# Altium schematic sheet S7_Power.SchDoc
size A3
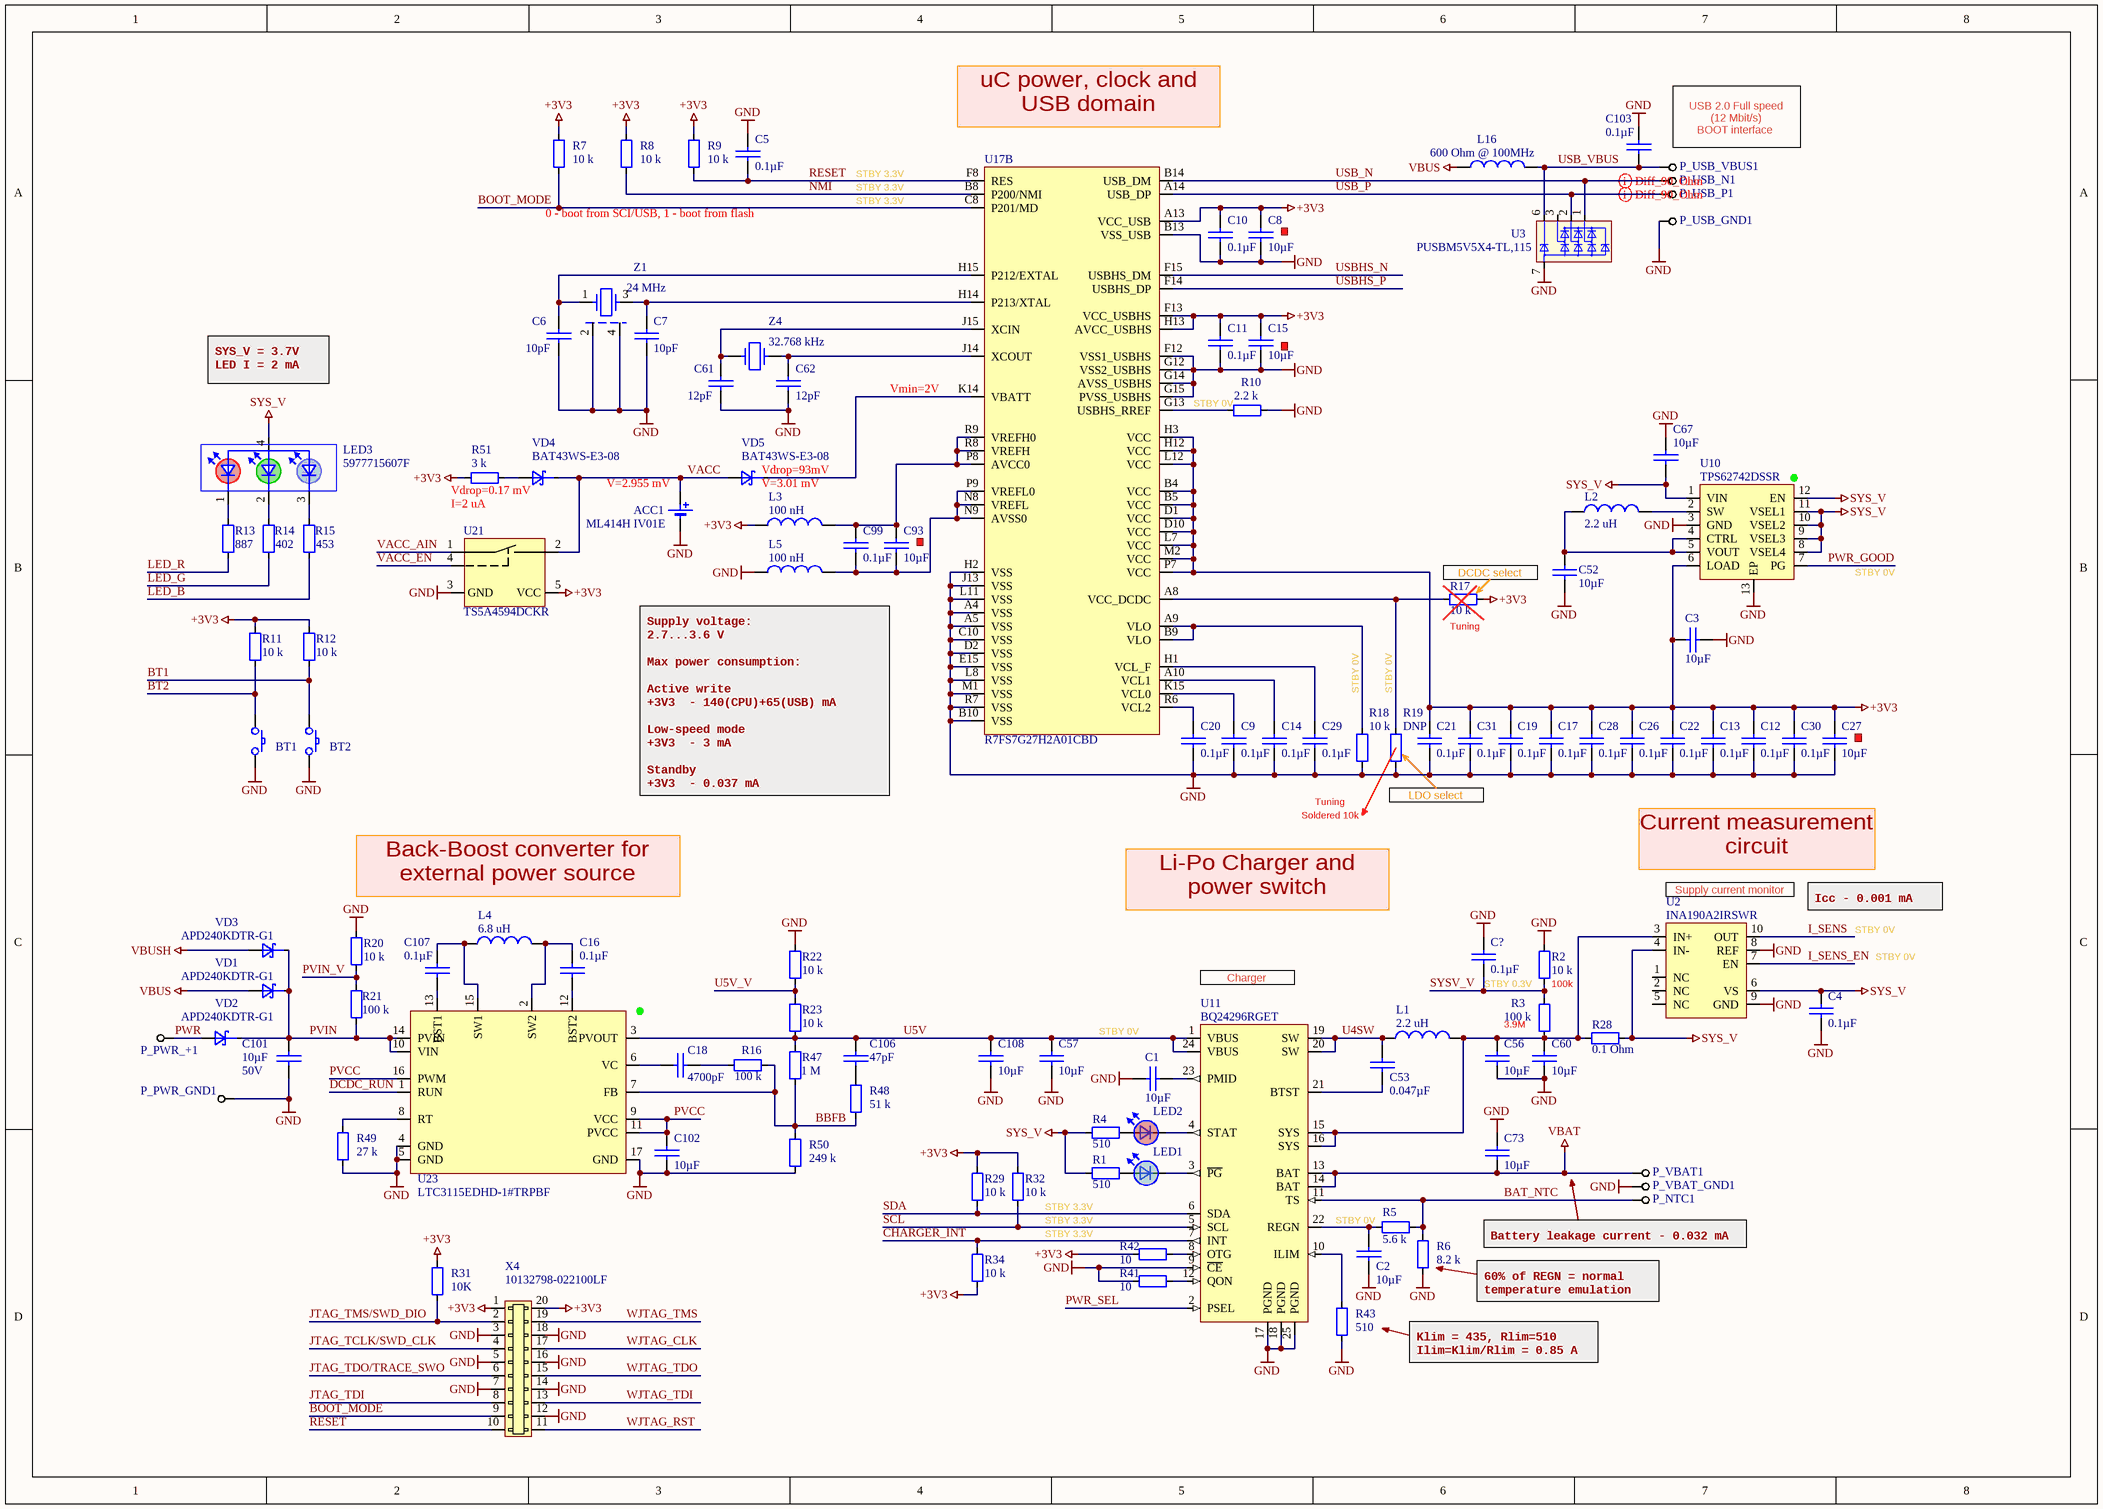
[diagram p0: S7_Power.SchDoc]

## Parts
ACC1  ML414H IV01E  [ML414H]
BT1  B3U-3000P  [B3U-3000P]  (value not drawn)
BT2  B3U-3000P  [B3U-3000P]  (value not drawn)
C1  value 10µF  [0603 CAP]  (hidden comment: Capacitor)
C2  value 10µF  [0603 CAP]  (hidden comment: Capacitor)
C3  value 10µF  [0603 CAP]  (hidden comment: Capacitor)
C4  value 0.1µF  [0402 CAP]  (hidden comment: Capacitor)
C5  value 0.1µF  [0402 CAP]  (hidden comment: Capacitor)
C6  value 10pF  [0402 CAP]  (hidden comment: Capacitor)
C7  value 10pF  [0402 CAP]  (hidden comment: Capacitor)
C8  value 10µF  [0603 CAP]  (hidden comment: Capacitor)
C9  value 0.1µF  [0402 CAP]  (hidden comment: Capacitor)
C10  value 0.1µF  [0402 CAP]  (hidden comment: Capacitor)
C11  value 0.1µF  [0402 CAP]  (hidden comment: Capacitor)
C12  value 0.1µF  [0402 CAP]  (hidden comment: Capacitor)
C13  value 0.1µF  [0402 CAP]  (hidden comment: Capacitor)
C14  value 0.1µF  [0402 CAP]  (hidden comment: Capacitor)
C15  value 10µF  [0603 CAP]  (hidden comment: Capacitor)
C16  value 0.1µF  [0603 CAP]  (hidden comment: Capacitor)
C17  value 0.1µF  [0402 CAP]  (hidden comment: Capacitor)
C18  value 4700pF  [0402 CAP]  (hidden comment: Capacitor)
C19  value 0.1µF  [0402 CAP]  (hidden comment: Capacitor)
C20  value 0.1µF  [0402 CAP]  (hidden comment: Capacitor)
C21  value 0.1µF  [0402 CAP]  (hidden comment: Capacitor)
C22  value 0.1µF  [0402 CAP]  (hidden comment: Capacitor)
C26  value 0.1µF  [0402 CAP]  (hidden comment: Capacitor)
C27  value 10µF  [0603 CAP]  (hidden comment: Capacitor)
C28  value 0.1µF  [0402 CAP]  (hidden comment: Capacitor)
C29  value 0.1µF  [0402 CAP]  (hidden comment: Capacitor)
C30  value 0.1µF  [0402 CAP]  (hidden comment: Capacitor)
C31  value 0.1µF  [0402 CAP]  (hidden comment: Capacitor)
C52  value 10µF  [0603 CAP]  (hidden comment: Capacitor)
C53  value 0.047µF  [0402 CAP]  (hidden comment: Capacitor)
C56  value 10µF  [0603 CAP]  (hidden comment: Capacitor)
C57  value 10µF  [0603 CAP]  (hidden comment: Capacitor)
C60  value 10µF  [0603 CAP]  (hidden comment: Capacitor)
C61  value 12pF  [0402 CAP]  (hidden comment: Capacitor)
C62  value 12pF  [0402 CAP]  (hidden comment: Capacitor)
C67  value 10µF  [0603 CAP]  (hidden comment: Capacitor)
C73  value 10µF  [0603 CAP]  (hidden comment: Capacitor)
C93  value 10µF  [0603 CAP]  (hidden comment: Capacitor)
C99  value 0.1µF  [0402 CAP]  (hidden comment: Capacitor)
C101  value 10µF  Voltage - Rated: 50V  [1210 CAP]  (hidden comment: Capacitor)
C102  value 10µF  [0603 CAP]  (hidden comment: Capacitor)
C103  value 0.1µF  [0402 CAP]  (hidden comment: Capacitor)
C106  value 47pF  [0402 CAP]  (hidden comment: Capacitor)
C107  value 0.1µF  [0603 CAP]  (hidden comment: Capacitor)
C108  value 10µF  [0603 CAP]  (hidden comment: Capacitor)
C?  value 0.1µF  [0402 CAP]  (hidden comment: Capacitor)
L1  value 2.2 uH  [IHLP-2020BZ-11]  (hidden comment: IHLP2020BZER2R2M01)
L2  value 2.2 uH  [744025002]  (hidden comment: 744025002)
L3  value 100 nH  [INDC1005-0402]  (hidden comment: MLG1005SR10JT000)
L4  value 6.8 uH  [ETQP3MxxxKVP]  (hidden comment: ETQ-P3M6R8KVP)
L5  value 100 nH  [INDC1005-0402]  (hidden comment: MLG1005SR10JT000)
L16  value 600 Ohm @ 100MHz  [0805]  (hidden comment: MPZ2012S601AT000)
LED1  SML-P11MTT86R  [0402 G LED]  (value not drawn)
LED2  SML-P11UTT86R  [0402 R LED]  (value not drawn)
LED3  5977715607F  [0606]
P_NTC1  PIN_TOP_1.5x2  [PIN_TOP_1.5x2]  (value not drawn)  (net tie, no BOM)
P_PWR_+1  PIN_TOP_1.5x2  [PIN_TOP_1.5x2]  (value not drawn)  (net tie, no BOM)
P_PWR_GND1  PIN_TOP_1.5x2  [PIN_TOP_1.5x2]  (value not drawn)  (net tie, no BOM)
P_USB_GND1  PIN_TOP_1.5x2  [PIN_TOP_1.5x2]  (value not drawn)  (net tie, no BOM)
P_USB_N1  PIN_TOP_1.5x2  [PIN_TOP_1.5x2]  (value not drawn)  (net tie, no BOM)
P_USB_P1  PIN_TOP_1.5x2  [PIN_TOP_1.5x2]  (value not drawn)  (net tie, no BOM)
P_USB_VBUS1  PIN_TOP_1.5x2  [PIN_TOP_1.5x2]  (value not drawn)  (net tie, no BOM)
P_VBAT1  PIN_TOP_1.5x2  [PIN_TOP_1.5x2]  (value not drawn)  (net tie, no BOM)
P_VBAT_GND1  PIN_TOP_1.5x2  [PIN_TOP_1.5x2]  (value not drawn)  (net tie, no BOM)
R1  value 510  [0402]  (hidden comment: Resistor)
R2  value 10 k  [0402]  (hidden comment: Resistor)
R3  value 100 k  [0402]  (hidden comment: Resistor)
R4  value 510  [0402]  (hidden comment: Resistor)
R5  value 5.6 k  [0402]  (hidden comment: Resistor)
R6  value 8.2 k  [0402]  (hidden comment: Resistor)
R7  value 10 k  [0402]  (hidden comment: Resistor)
R8  value 10 k  [0402]  (hidden comment: Resistor)
R9  value 10 k  [0402]  (hidden comment: Resistor)
R10  value 2.2 k  [0402]  (hidden comment: Resistor)
R11  value 10 k  [0402]  (hidden comment: Resistor)
R12  value 10 k  [0402]  (hidden comment: Resistor)
R13  value 887  [0402]  (hidden comment: Resistor)
R14  value 402  [0402]  (hidden comment: Resistor)
R15  value 453  [0402]  (hidden comment: Resistor)
R16  value 100 k  [0402]  (hidden comment: Resistor)
R17  value 10 k  [0402]  (hidden comment: Resistor)
R18  value 10 k  [0402]  (hidden comment: Resistor)
R19  value DNP  [0402]  (hidden comment: Resistor)  (no BOM)
R20  value 10 k  [0402]  (hidden comment: Resistor)
R21  value 100 k  [0402]  (hidden comment: Resistor)
R22  value 10 k  [0402]  (hidden comment: Resistor)
R23  value 10 k  [0402]  (hidden comment: Resistor)
R28  value 0.1 Ohm  [0603]  (hidden comment: ERJ-3BWFR100V)
R29  value 10 k  [0402]  (hidden comment: Resistor)
R31  value 10K  [0402]  (hidden comment: MCR01MZPJ103)
R32  value 10 k  [0402]  (hidden comment: Resistor)
R34  value 10 k  [0402]  (hidden comment: Resistor)
R41  value 10  [0402]  (hidden comment: Resistor)
R42  value 10  [0402]  (hidden comment: Resistor)
R43  value 510  [0402]  (hidden comment: Resistor)
R47  value 1 M  [0402]  (hidden comment: Resistor)
R48  value 51 k  [0402]  (hidden comment: Resistor)
R49  value 27 k  [0402]  (hidden comment: Resistor)
R50  value 249 k  [0402]  (hidden comment: Resistor)
R51  value 3 k  [0402]  (hidden comment: Resistor)
U2  INA190A2IRSWR  [uQFN-10]
U3  PUSBM5V5X4-TL,115  [DFN1616-6]
U10  TPS62742DSSR  [12-WSON]
U11  BQ24296RGET  [TI S-PVQFN-N24]
U17  R7FS7G27H2A01CBD  [RENESAS_FBGA224]  (part B of 2)
U21  TS5A4594DCKR  [SOT-353 ON Semi]
U23  LTC3115EDHD-1#TRPBF  [DFN-16]
VD1  PartName: APD240KDTR-G1  [SOD-123]  (hidden comment: Schottky)
VD2  PartName: APD240KDTR-G1  [SOD-123]  (hidden comment: Schottky)
VD3  PartName: APD240KDTR-G1  [SOD-123]  (hidden comment: Schottky)
VD4  PartName: BAT43WS-E3-08  [SOD-323]  (hidden comment: Schottky)
VD5  PartName: BAT43WS-E3-08  [SOD-323]  (hidden comment: Schottky)
X4  10132798-022100LF  [10132798-022100LF]
Z1  value 24 MHz  [4-SMD 2.00mm x 1.60mm]  (hidden comment: ABM11-24.000MHZ-D2X-T3)
Z4  value 32.768 kHz  [ABS7]  (hidden comment: ABS07-32.768KHZ-T)

## Nets
+3V3: C3.1 C8.1 C10.1 C11.1 C12.1 C13.1 C15.1 C17.1 C19.1 C21.1 C22.1 C26.1 C27.1 C28.1 C30.1 C31.1 L3.1 R7.2 R8.2 R9.2 R11.2 R12.2 R17.1 R29.2 R31.2 R32.2 R34.1 R42.1 R51.1 U10.6(LOAD) U17.A13(VCC_USB) U17.B4(VCC) U17.B5(VCC) U17.D1(VCC) U17.D10(VCC) U17.F13(VCC_USBHS) U17.H3(VCC) U17.H12(VCC) U17.H13(AVCC_USBHS) U17.L7(VCC) U17.L12(VCC) U17.M2(VCC) U17.P7(VCC) U21.5(VCC) X4.1 X4.20
GND: ACC1.1 BT1.2 BT2.2 C1.1 C2.2 C3.2 C4.2 C5.2 C6.2 C7.2 C8.2 C9.2 C10.2 C11.2 C12.2 C13.2 C14.2 C15.2 C17.2 C19.2 C20.2 C21.2 C22.2 C26.2 C27.2 C28.2 C29.2 C30.2 C31.2 C52.1 C56.2 C57.2 C60.2 C61.2 C62.2 C67.1 C73.1 C101.2 C102.2 C103.1 C108.2 C?.1 L5.1 P_PWR_GND1.1 P_USB_GND1.1 P_VBAT_GND1.1 R2.2 R6.1 R10.2 R18.1 R19.1 R20.2 R22.2 R41.1 R43.2 R49.1 R50.1 U2.8(REF) U2.9(GND) U3.7 U10.3(GND) U10.13(EP) U11.9(~{CE}) U11.17(PGND) U11.18(PGND) U11.25(PGND) U17.A4(VSS) U17.A5(VSS) U17.B10(VSS) U17.B13(VSS_USB) U17.C10(VSS) U17.D2(VSS) U17.E15(VSS) U17.F12(VSS1_USBHS) U17.G12(VSS2_USBHS) U17.G14(AVSS_USBHS) U17.G15(PVSS_USBHS) U17.H2(VSS) U17.J13(VSS) U17.L8(VSS) U17.L11(VSS) U17.M1(VSS) U17.R7(VSS) U21.3(GND) U23.4(GND) U23.5(GND) U23.17(GND) X4.3 X4.5 X4.7 X4.12 X4.14 X4.16 X4.18 Z1.2 Z1.4
SYS_V: C4.1 C67.2 LED3.4 R1.2 R4.2 R28.2 U2.4(IN-) U2.6(VS) U10.1(VIN) U10.8(VSEL4) U10.9(VSEL3) U10.10(VSEL2) U10.11(VSEL1) U10.12(EN)
VBAT: C73.2 P_VBAT1.1 U11.13(BAT) U11.14(BAT)
VBUS: L16.2 VD1.2(A)
VBUSH: VD3.2(A)
BAT_NTC: P_NTC1.1 R5.2 R6.2 U11.11(TS)
BBFB: R16.2 R47.1 R48.1 R50.2 U23.7(FB)
BOOT_MODE: R7.1 U17.C8(P201/MD) X4.9
BT1: BT2.1 R12.1
BT2: BT1.1 R11.1
CHARGER_INT: R34.2 U11.7(INT)
DCDC_RUN: U23.1(RUN)
I_SENS: U2.10(OUT)
I_SENS_EN: U2.7(EN)
JTAG_TCLK/SWD_CLK: X4.4
JTAG_TDI: X4.8
JTAG_TDO/TRACE_SWO: X4.6
JTAG_TMS/SWD_DIO: R31.1 X4.2
LED_B: R15.1
LED_G: R14.1
LED_R: R13.1
NMI: R8.1 U17.B8(P200/NMI)
PVCC: C102.1 U23.9(VCC) U23.11(PVCC) U23.16(PWM)
PVIN: C101.1 R21.1 U23.10(VIN) U23.14(PVIN) VD1.1(C) VD2.1(C) VD3.1(C)
PVIN_V: R20.1 R21.2
PWR: P_PWR_+1.1 VD2.2(A)
PWR_GOOD: U10.7(PG)
PWR_SEL: U11.2(PSEL)
RESET: C5.1 R9.1 U17.F8(RES) X4.10
SCL: R32.1 U11.5(SCL)
SDA: R29.1 U11.6(SDA)
SYSV_V: C?.2 R2.1 R3.2
U4SW: C53.1 L1.1 U11.19(SW) U11.20(SW)
U5V: C57.1 C106.1 C108.1 R23.1 R47.2 U11.1(VBUS) U11.24(VBUS) U23.3(PVOUT)
U5V_V: R22.1 R23.2
USB_N: P_USB_N1.1 U3.1 U17.B14(USB_DM)
USB_P: P_USB_P1.1 U3.2 U17.A14(USB_DP)
USB_VBUS: C103.2 L16.1 P_USB_VBUS1.1 U3.6
USBHS_N: U17.F15(USBHS_DM)
USBHS_P: U17.F14(USBHS_DP)
VACC: ACC1.2 U21.2(NO) VD4.1(C) VD5.2(A)
VACC_AIN: U21.1(COM)
VACC_EN: U21.4(IN)
WJTAG_CLK: X4.17
WJTAG_RST: X4.11
WJTAG_TDI: X4.13
WJTAG_TDO: X4.15
WJTAG_TMS: X4.19
NetC1_2: C1.2 U11.23(PMID)
NetC2_1: C2.1 R5.1 U11.22(REGN)
NetC6_1: C6.1 U17.H15(P212/EXTAL) Z1.1
NetC7_1: C7.1 U17.H14(P213/XTAL) Z1.3
NetC9_1: C9.1 U17.K15(VCL0)
NetC14_1: C14.1 U17.A10(VCL1)
NetC16_1: C16.1 L4.2 U23.2(SW2)
NetC16_2: C16.2 U23.12(BST2)
NetC18_1: C18.1 U23.6(VC)
NetC18_2: C18.2 R16.1
NetC20_1: C20.1 U17.R6(VCL2)
NetC29_1: C29.1 U17.H1(VCL_F)
NetC52_2: C52.2 L2.1 U10.4(CTRL) U10.5(VOUT)
NetC53_2: C53.2 U11.21(BTST)
NetC56_1: C56.1 C60.1 L1.2 R3.1 R28.1 U2.3(IN+) U11.15(SYS) U11.16(SYS)
NetC61_1: C61.1 U17.J15(XCIN) Z4.1
NetC62_1: C62.1 U17.J14(XCOUT) Z4.2
NetC93_1: C93.1 C99.1 L3.2 U17.P8(AVCC0) U17.R8(VREFH) U17.R9(VREFH0)
NetC93_2: C93.2 C99.2 L5.2 U17.N8(VREFL) U17.N9(AVSS0) U17.P9(VREFL0)
NetC106_2: C106.2 R48.2
NetC107_1: C107.1 L4.1 U23.15(SW1)
NetC107_2: C107.2 U23.13(BST1)
NetL2_2: L2.2 U10.2(SW)
NetLED1_1: LED1.1(K) U11.3(~{PG})
NetLED1_2: LED1.2 R1.1
NetLED2_1: LED2.1(K) U11.4(STAT)
NetLED2_2: LED2.2 R4.1
NetLED3_1: LED3.1 R13.2
NetLED3_2: LED3.2 R14.2
NetLED3_3: LED3.3 R15.2
NetR10_1: R10.1 U17.G13(USBHS_RREF)
NetR17_2: R17.2 R19.2 U17.A8(VCC_DCDC)
NetR18_2: R18.2 U17.A9(VLO) U17.B9(VLO)
NetR41_2: R41.2 U11.12(QON)
NetR42_2: R42.2 U11.8(OTG)
NetR43_1: R43.1 U11.10(ILIM)
NetR49_2: R49.2 U23.8(RT)
NetR51_2: R51.2 VD4.2(A)
NetU17_K14: U17.K14(VBATT) VD5.1(C)

Not connected (* = marked no-connect by the designer): U2 1(NC) 2(NC) 5(NC); U3 3

## Layout directives
differential pair; rule Differential Pairs Routing [Pref Gap = 0.127mm    Min Gap  = 0.127mm    Max Gap  = 0.127mmPref Width = 0.138mm    Min Width  = 0.075mm    Max Width  = 0.138mm]: USB_N, USB_P

## Notes on the sheet
- STBY 3.3V
- uC power, clock and USB domain
- USB 2.0 Full speed
  (12 Mbit/s)
  BOOT interface
- 0 - boot from SCI/USB, 1 - boot from flash
- SYS_V = 3.7V
  LED I = 2 mA
- (near U17) Vmin=2V
- (near R10) STBY 0V
- Vdrop=0.17 mV
- (near R51) I=2 uA
- (near ACC1) V=2.955 mV
- (near VD5) Vdrop=93mV
- (near VD5) V=3.01 mV
- DCDC select
- STBY 0V
- (near R17) Tuning
- Supply voltage:
  2.7...3.6 V
  Max power consumption:
  Active write
  +3V3  - 140(CPU)+65(USB) mA
  Low-speed mode
  +3V3  - 3 mA
  Standby
  +3V3  - 0.037 mA
- Soldered 10k
- Tuning
- LDO select
- Back-Boost converter for external power source
- Li-Po Charger and power switch
- Current measurement circuit
- (near U2) Supply current monitor
- Icc - 0.001 mA
- Charger
- STBY 0.3V
- (near R2) 100k
- 3.9M
- Battery leakage current - 0.032 mA
- 60% of REGN = normal temperature emulation
- Klim = 435, Rlim=510
  Ilim=Klim/Rlim = 0.85 A

## Library data of the parts
ACC1 = ML414H IV01E: Coin, 4.8mm 3V Lithium Battery Rechargeable (Secondary) 1mAh; PartNum: 728-1052-1-ND; Manufacturer: Seiko Instruments; Distributor: Digi-Key; PartName: ML414H IV01E
BT1 BT2 = B3U-3000P: Tactile Switch SPST-NO Side Actuated Surface Mount, Right Angle; Manufacturer: Omron Electronics Inc-EMC Div; PartNum: SW1022CT-ND; Distributor: Digi-Key; Price: 1$; PartName: B3U-3000P
C1-C3 C27 C52 C56 C57 C60 C67 C102 C108 = GRT188R61C106KE13D: 10µF, ±10%, 16V, X5R, 0603 (1608 Metric), -55°C ~ 85°C, -, Automotive; Manufacturer: Murata Electronics North America; PartNum: 490-12317-1-ND; Voltage - Rated: 16V; Part Number: GRT188R61C106KE13D; Distributor: Digi-Key; PartName: GRT188R61C106KE13D; Price: 0.22770; Tolerance: ±10%; Temperature Coefficient: X5R; Operating Temperature: -55°C ~ 85°C; Features: -; Package / Case: 0603 (1608 Metric)
C4 C5 C9-C14 C17 C19-C22 C26 C28-C31 C99 C103 C? = 0402B104K500CT: 0.1µF, ±10%, 50V, X7R, 0402 (1005 Metric), -55°C ~ 125°C, -, General Purpose; Manufacturer: Walsin Technology Corporation; PartNum: 1292-1176-1-ND; Voltage - Rated: 50V; Part Number: 0402B104K500CT; Distributor: Digi-Key; PartName: 0402B104K500CT; Price: 0.19000; Tolerance: ±10%; Temperature Coefficient: X7R; Operating Temperature: -55°C ~ 125°C; Features: -; Package / Case: 0402 (1005 Metric)
C6 C7 = GCM1555C1H100FA16D: 10pF, ±1%, 50V, C0G, NP0, 0402 (1005 Metric), -55°C ~ 125°C, -, Automotive; Manufacturer: Murata Electronics North America; PartNum: 490-14348-1-ND; Voltage - Rated: 50V; Part Number: GCM1555C1H100FA16D; Distributor: Digi-Key; PartName: GCM1555C1H100FA16D; Price: 0.15000; Tolerance: ±1%; Temperature Coefficient: C0G, NP0; Operating Temperature: -55°C ~ 125°C; Features: -; Package / Case: 0402 (1005 Metric)
C8 C15 C73 C93 = GRM188R61A106ME69D: 10µF, ±20%, 10V, X5R, 0603 (1608 Metric), -55°C ~ 85°C, -, General Purpose; Manufacturer: Murata Electronics North America; PartNum: 490-10475-1-ND; Voltage - Rated: 10V; Part Number: GRM188R61A106ME69D; Distributor: Digi-Key; PartName: GRM188R61A106ME69D; Price: 0.07540; Tolerance: ±20%; Temperature Coefficient: X5R; Operating Temperature: -55°C ~ 85°C; Features: -; Package / Case: 0603 (1608 Metric)
C16 C107 = UMK107BJ104KAHT: 0.1µF, ±10%, 50V, X5R, 0603 (1608 Metric), -55°C ~ 85°C, -, Automotive; Manufacturer: Taiyo Yuden; PartNum: 587-3504-1-ND; Voltage - Rated: 50V; Part Number: UMK107BJ104KAHT; Distributor: Digi-Key; PartName: UMK107BJ104KAHT; Price: 0.05040; Tolerance: ±10%; Temperature Coefficient: X5R; Operating Temperature: -55°C ~ 85°C; Features: -; Package / Case: 0603 (1608 Metric)
C18 = CGA2B2X7R1H472K050BA: 4700pF, ±10%, 50V, X7R, 0402 (1005 Metric), -55°C ~ 125°C, -, Automotive; Manufacturer: TDK Corporation; PartNum: 445-5607-1-ND; Voltage - Rated: 50V; Part Number: CGA2B2X7R1H472K050BA; Distributor: Digi-Key; PartName: CGA2B2X7R1H472K050BA; Price: 0.10000; Tolerance: ±10%; Temperature Coefficient: X7R; Operating Temperature: -55°C ~ 125°C; Features: -; Package / Case: 0402 (1005 Metric)
C53 = CC0402KRX7R8BB473: 0.047µF, ±10%, 25V, X7R, 0402 (1005 Metric), -55°C ~ 125°C, -, General Purpose; Manufacturer: Yageo; PartNum: 311-1717-1-ND; Voltage - Rated: 25V; Part Number: CC0402KRX7R8BB473; Distributor: Digi-Key; PartName: CC0402KRX7R8BB473; Price: 0.10000; Tolerance: ±10%; Temperature Coefficient: X7R; Operating Temperature: -55°C ~ 125°C; Features: -; Package / Case: 0402 (1005 Metric)
C61 C62 = 0402N120G500CT: 12pF, ±2%, 50V, C0G, NP0, 0402 (1005 Metric), -55°C ~ 125°C, -, General Purpose; Manufacturer: Walsin Technology Corporation; PartNum: 1292-1250-1-ND; Voltage - Rated: 50V; Part Number: 0402N120G500CT; Distributor: Digi-Key; PartName: 0402N120G500CT; Price: 0.10000; Tolerance: ±2%; Temperature Coefficient: C0G, NP0; Operating Temperature: -55°C ~ 125°C; Features: -; Package / Case: 0402 (1005 Metric)
C101 = GCM32EC71H106KA03K: 10µF, ±10%, 50V, X7S, 1210 (3225 Metric), -55°C ~ 125°C, -, Automotive; Manufacturer: Murata Electronics North America; PartNum: 490-14535-1-ND; Part Number: GCM32EC71H106KA03K; Distributor: Digi-Key; PartName: GCM32EC71H106KA03K; Price: 0.64430; Tolerance: ±10%; Temperature Coefficient: X7S; Operating Temperature: -55°C ~ 125°C; Features: -; Package / Case: 1210 (3225 Metric)
C106 = 885012005059: 47pF, ±5%, 50V, C0G, NP0, 0402 (1005 Metric), -55°C ~ 125°C, -, General Purpose; Manufacturer: Wurth Electronics Inc.; PartNum: 732-7473-1-ND; Voltage - Rated: 50V; Part Number: 885012005059; Distributor: Digi-Key; PartName: 885012005059; Price: 0.10000; Tolerance: ±5%; Temperature Coefficient: C0G, NP0; Operating Temperature: -55°C ~ 125°C; Features: -; Package / Case: 0402 (1005 Metric)
L1 = IHLP2020BZER2R2M01: 2.2 uH, 4.2 A, 50 mOhms, +-20%,-55.. +125 C; Manufacturer: Vishay Dale; PartNum: 541-1088-1-ND; Tolerance: ±20%; Distributor: Digi-Key; PartName: IHLP2020BZER2R2M01
L2 = 744025002: Inductors 2.2 uH, 1.8 A, 0.066 Ohms, ±20% -40°C ~ 125°C, 2.8 x 2.8 mm; Manufacturer: Wurth Electronics Inc; PartNum: 732-2613-1-ND; Distributor: Digi-Key; Tolerance: ±20%; PartName: 744025002
L3 L5 = MLG1005SR10JT000: 100nH, ±5%, 200 мА, 2 Ohm, 0402, -55..+125 C; Manufacturer: TDK Corporation; PartNum: 445-3071-1-ND; Tolerance: ±5%; Distributor: Digi-Key; PartName: MLG1005SR10JT000
L4 = ETQ-P3M6R8KVP: Inductors 6.8 uH, 3.5 A, 0.072 Ohms, ±20% -55°C ~ 155°C, 5.5 x 5 mm; Manufacturer: Panasonic Electronic Components; PartNum: P19756CT-ND; Distributor: Digi-Key; Tolerance: ±20%; PartName: ETQ-P3M6R8KVP
L16 = MPZ2012S601AT000: FERRITE BEAD 600 OHM, 0805, -55°C ~ 125°C; Manufacturer: TDK Corporation; PartNum: 445-2206-1-ND; Distributor: Digi-Key; Price: 0.05$; PartName: MPZ2012S601AT000
LED1 = SML-P11MTT86R: Green-Yellow 569nm LED Indication - Discrete 1.9V 0402 (1006 Metric); Manufacturer: Rohm Semiconductor; PartNum: 846-1211-1-ND; Value: Green; Distributor: Digi-Key; PartName: SML-P11MTT86R
LED2 = SML-P11UTT86R: Red 621nm LED Indication - Discrete 1.8V 0402 (1006 Metric); Manufacturer: Rohm Semiconductor; PartNum: SML-P11UTT86RCT-ND; Distributor: Digi-Key; Value: Red; PartName: SML-P11UTT86R
LED3 = 5977715607F: Red, Green, Blue (RGB) LED Indication - Discrete 1.95V Red, 2.9V Green, 2.8V Blue 0606 (1616 Metric); Manufacturer: Dialight; PartNum: 350-4396-1-ND; Distributor: Digi-Key; Price: 0.74$; PartName: 5977715607F
P_NTC1 P_PWR_+1 P_PWR_GND1 P_USB_GND1 P_USB_N1 P_USB_P1 P_USB_VBUS1 P_VBAT1 P_VBAT_GND1 = PIN_TOP_1.5x2: Pin on TOP layer 1.5 x 2 mm
R1 R4 R43 = RMCF0402FT510R: 510 Ohms, ±1%, 0.063W, 1/16W, Thick Film, ±100ppm/°C, 0402 (1005 Metric), -55°C ~ 155°C, Automotive AEC-Q200; Manufacturer: Stackpole Electronics Inc; PartNum: RMCF0402FT510RCT-ND; Voltage: 75V; Distributor: Digi-Key; Price: 0.10000; Tolerance: ±1%; PartName: RMCF0402FT510R; Part Number: RMCF0402FT510R; Temperature Coefficient: ±100ppm/°C; Operating Temperature: -55°C ~ 155°C; Power (Watts): 0.063W, 1/16W; Features: Automotive AEC-Q200; Package / Case: 0402 (1005 Metric)
R2 R7-R9 R11 R12 R17-R20 R22 R23 R29 R32 R34 = RMCF0402FT10K0: 10 kOhms, ±1%, 0.063W, 1/16W, Thick Film, ±100ppm/°C, 0402 (1005 Metric), -55°C ~ 155°C, Automotive AEC-Q200; Manufacturer: Stackpole Electronics Inc; PartNum: RMCF0402FT10K0CT-ND; Voltage: 75V; Distributor: Digi-Key; Price: 0.10000; Tolerance: ±1%; PartName: RMCF0402FT10K0; Part Number: RMCF0402FT10K0; Temperature Coefficient: ±100ppm/°C; Operating Temperature: -55°C ~ 155°C; Power (Watts): 0.063W, 1/16W; Features: Automotive AEC-Q200; Package / Case: 0402 (1005 Metric)
R3 R16 R21 = RMCF0402FT100K: 100 kOhms, ±1%, 0.063W, 1/16W, Thick Film, ±100ppm/°C, 0402 (1005 Metric), -55°C ~ 155°C, Automotive AEC-Q200; Manufacturer: Stackpole Electronics Inc; PartNum: RMCF0402FT100KCT-ND; Voltage: 75V; Distributor: Digi-Key; Price: 0.10000; Tolerance: ±1%; PartName: RMCF0402FT100K; Part Number: RMCF0402FT100K; Temperature Coefficient: ±100ppm/°C; Operating Temperature: -55°C ~ 155°C; Power (Watts): 0.063W, 1/16W; Features: Automotive AEC-Q200; Package / Case: 0402 (1005 Metric)
R5 = RMCF0402FT5K60: 5.6 kOhms, ±1%, 0.063W, 1/16W, Thick Film, ±100ppm/°C, 0402 (1005 Metric), -55°C ~ 155°C, Automotive AEC-Q200; Manufacturer: Stackpole Electronics Inc; PartNum: RMCF0402FT5K60CT-ND; Voltage: 75V; Distributor: Digi-Key; Price: 0.10000; Tolerance: ±1%; PartName: RMCF0402FT5K60; Part Number: RMCF0402FT5K60; Temperature Coefficient: ±100ppm/°C; Operating Temperature: -55°C ~ 155°C; Power (Watts): 0.063W, 1/16W; Features: Automotive AEC-Q200; Package / Case: 0402 (1005 Metric)
R6 = RMCF0402FT8K20: 8.2 kOhms, ±1%, 0.063W, 1/16W, Thick Film, ±100ppm/°C, 0402 (1005 Metric), -55°C ~ 155°C, Automotive AEC-Q200; Manufacturer: Stackpole Electronics Inc; PartNum: RMCF0402FT8K20CT-ND; Voltage: 75V; Distributor: Digi-Key; Price: 0.10000; Tolerance: ±1%; PartName: RMCF0402FT8K20; Part Number: RMCF0402FT8K20; Temperature Coefficient: ±100ppm/°C; Operating Temperature: -55°C ~ 155°C; Power (Watts): 0.063W, 1/16W; Features: Automotive AEC-Q200; Package / Case: 0402 (1005 Metric)
R10 = RMCF0402FT2K20: 2.2 kOhms, ±1%, 0.063W, 1/16W, Thick Film, ±100ppm/°C, 0402 (1005 Metric), -55°C ~ 155°C, Automotive AEC-Q200; Manufacturer: Stackpole Electronics Inc; PartNum: RMCF0402FT2K20CT-ND; Voltage: 75V; Distributor: Digi-Key; Price: 0.10000; Tolerance: ±1%; PartName: RMCF0402FT2K20; Part Number: RMCF0402FT2K20; Temperature Coefficient: ±100ppm/°C; Operating Temperature: -55°C ~ 155°C; Power (Watts): 0.063W, 1/16W; Features: Automotive AEC-Q200; Package / Case: 0402 (1005 Metric)
R13 = RMCF0402FT887R: 887 Ohms, ±1%, 0.063W, 1/16W, Thick Film, ±100ppm/°C, 0402 (1005 Metric), -55°C ~ 155°C, Automotive AEC-Q200; Manufacturer: Stackpole Electronics Inc; PartNum: RMCF0402FT887RCT-ND; Voltage: 75V; Distributor: Digi-Key; Price: 0.10000; Tolerance: ±1%; PartName: RMCF0402FT887R; Part Number: RMCF0402FT887R; Temperature Coefficient: ±100ppm/°C; Operating Temperature: -55°C ~ 155°C; Power (Watts): 0.063W, 1/16W; Features: Automotive AEC-Q200; Package / Case: 0402 (1005 Metric)
R14 = RMCF0402FT402R: 402 Ohms, ±1%, 0.063W, 1/16W, Thick Film, ±100ppm/°C, 0402 (1005 Metric), -55°C ~ 155°C, Automotive AEC-Q200; Manufacturer: Stackpole Electronics Inc; PartNum: RMCF0402FT402RCT-ND; Voltage: 75V; Distributor: Digi-Key; Price: 0.10000; Tolerance: ±1%; PartName: RMCF0402FT402R; Part Number: RMCF0402FT402R; Temperature Coefficient: ±100ppm/°C; Operating Temperature: -55°C ~ 155°C; Power (Watts): 0.063W, 1/16W; Features: Automotive AEC-Q200; Package / Case: 0402 (1005 Metric)
R15 = RMCF0402FT453R: 453 Ohms, ±1%, 0.063W, 1/16W, Thick Film, ±100ppm/°C, 0402 (1005 Metric), -55°C ~ 155°C, Automotive AEC-Q200; Manufacturer: Stackpole Electronics Inc; PartNum: RMCF0402FT453RCT-ND; Voltage: 75V; Distributor: Digi-Key; Price: 0.10000; Tolerance: ±1%; PartName: RMCF0402FT453R; Part Number: RMCF0402FT453R; Temperature Coefficient: ±100ppm/°C; Operating Temperature: -55°C ~ 155°C; Power (Watts): 0.063W, 1/16W; Features: Automotive AEC-Q200; Package / Case: 0402 (1005 Metric)
R28 = ERJ-3BWFR100V: Curr.sens.res. 0.1 Ohm, 1% , 0.333W, 0603; Manufacturer: Panasonic Electronic Components; PartNum: P17478CT-ND; Distributor: Digi-Key; Tolerance: ±1%; PartName: ERJ-3BWFR100V
R31 = MCR01MZPJ103: 10 K, 0402, Thick Film, -55..+155; Manufacturer: Rohm Semiconductor; PartNum: RHM10KJTR-ND; Tolerance: 5%; Distributor: Digi-Key; Price: 0.1$; PartName: MCR01MZPJ103
R41 R42 = RMCF0402FT10R0: 10 Ohms, ±1%, 0.063W, 1/16W, Thick Film, ±100ppm/°C, 0402 (1005 Metric), -55°C ~ 155°C, Automotive AEC-Q200; Manufacturer: Stackpole Electronics Inc; PartNum: RMCF0402FT10R0CT-ND; Voltage: 75V; Distributor: Digi-Key; Price: 0.10000; Tolerance: ±1%; PartName: RMCF0402FT10R0; Part Number: RMCF0402FT10R0; Temperature Coefficient: ±100ppm/°C; Operating Temperature: -55°C ~ 155°C; Power (Watts): 0.063W, 1/16W; Features: Automotive AEC-Q200; Package / Case: 0402 (1005 Metric)
R47 = RMCF0402FT1M00: 1 MOhms, ±1%, 0.063W, 1/16W, Thick Film, ±100ppm/°C, 0402 (1005 Metric), -55°C ~ 155°C, Automotive AEC-Q200; Manufacturer: Stackpole Electronics Inc; PartNum: RMCF0402FT1M00CT-ND; Voltage: 75V; Distributor: Digi-Key; Price: 0.10000; Tolerance: ±1%; PartName: RMCF0402FT1M00; Part Number: RMCF0402FT1M00; Temperature Coefficient: ±100ppm/°C; Operating Temperature: -55°C ~ 155°C; Power (Watts): 0.063W, 1/16W; Features: Automotive AEC-Q200; Package / Case: 0402 (1005 Metric)
R48 = RMCF0402FT51K0: 51 kOhms, ±1%, 0.063W, 1/16W, Thick Film, ±100ppm/°C, 0402 (1005 Metric), -55°C ~ 155°C, Automotive AEC-Q200; Manufacturer: Stackpole Electronics Inc; PartNum: RMCF0402FT51K0CT-ND; Voltage: 75V; Distributor: Digi-Key; Price: 0.10000; Tolerance: ±1%; PartName: RMCF0402FT51K0; Part Number: RMCF0402FT51K0; Temperature Coefficient: ±100ppm/°C; Operating Temperature: -55°C ~ 155°C; Power (Watts): 0.063W, 1/16W; Features: Automotive AEC-Q200; Package / Case: 0402 (1005 Metric)
R49 = RMCF0402FT27K0: 27 kOhms, ±1%, 0.063W, 1/16W, Thick Film, ±100ppm/°C, 0402 (1005 Metric), -55°C ~ 155°C, Automotive AEC-Q200; Manufacturer: Stackpole Electronics Inc; PartNum: RMCF0402FT27K0CT-ND; Voltage: 75V; Distributor: Digi-Key; Price: 0.10000; Tolerance: ±1%; PartName: RMCF0402FT27K0; Part Number: RMCF0402FT27K0; Temperature Coefficient: ±100ppm/°C; Operating Temperature: -55°C ~ 155°C; Power (Watts): 0.063W, 1/16W; Features: Automotive AEC-Q200; Package / Case: 0402 (1005 Metric)
R50 = RMCF0402FT249K: 249 kOhms, ±1%, 0.063W, 1/16W, Thick Film, ±100ppm/°C, 0402 (1005 Metric), -55°C ~ 155°C, Automotive AEC-Q200; Manufacturer: Stackpole Electronics Inc; PartNum: RMCF0402FT249KCT-ND; Voltage: 75V; Distributor: Digi-Key; Price: 0.10000; Tolerance: ±1%; PartName: RMCF0402FT249K; Part Number: RMCF0402FT249K; Temperature Coefficient: ±100ppm/°C; Operating Temperature: -55°C ~ 155°C; Power (Watts): 0.063W, 1/16W; Features: Automotive AEC-Q200; Package / Case: 0402 (1005 Metric)
R51 = RMCF0402FT3K00: 3 kOhms, ±1%, 0.063W, 1/16W, Thick Film, ±100ppm/°C, 0402 (1005 Metric), -55°C ~ 155°C, Automotive AEC-Q200; Manufacturer: Stackpole Electronics Inc; PartNum: RMCF0402FT3K00CT-ND; Voltage: 75V; Distributor: Digi-Key; Price: 0.10000; Tolerance: ±1%; PartName: RMCF0402FT3K00; Part Number: RMCF0402FT3K00; Temperature Coefficient: ±100ppm/°C; Operating Temperature: -55°C ~ 155°C; Power (Watts): 0.063W, 1/16W; Features: Automotive AEC-Q200; Package / Case: 0402 (1005 Metric)
U2 = INA190A2IRSWR: Current Sense Amplifier, 50V/V, 33 kHz, Vcm=–0.2 V to +40 V, Vcc=1.7V ~ 5.5V, , Icc=40µA, -40°C ~ 125°C, 10-UQFN (1.8x1.4); Manufacturer: Texas Instruments; PartNum: 296-51130-1-ND; Distributor: Digi-Key; PartName: INA190A2IRSWR
U3 = PUSBM5V5X4-TL,115: TVS DIODE 5.5VWM 12VC 6HXSON; Manufacturer: NXP Semiconductors; PartNum: 568-10921-1-ND; Distributor: Digi-Key; PartName: PUSBM5V5X4-TL,115
U10 = TPS62742DSSR: DCDC 1.8-3.3V, 400mA , Iq=360nA, -40°C ~ 85°C, 12-WSON (3x2); Manufacturer: Texas Instruments; PartNum: 296-40852-1-ND; Distributor: Digi-Key; price: 1.93$; PartName: TPS62742DSSR
U11 = BQ24296RGET: IC LI+ CHARGER PWR MGMT 24VQFN; PartNum: 296-39592-1-ND; Manufacturer: TI; PartName: BQ24296RGET; Distributor: Digi-Key
U17 = R7FS7G27H2A01CBD#AC0: Manufacturer: Renesas; PartNum: R7FS7G27H2A01CBD#AC0-ND; Distributor: Digi-Key; PartName: R7FS7G27H2A01CBD#AC0; Price: 24$
U21 = TS5A4594DCKR: 1 Circuit IC Switch 1:1 8 Ohm, -40°C ~ 85°C,  SC-70-5; Manufacturer: Texas Instruments; PartNum: 296-17706-1-ND; Distributor: Digi-Key; PartName: TS5A4594DCKR
U23 = LTC3115EDHD-1#TRPBF: Buck-Boost IC Positive Adjustable 2.2...40V, 2A, -40°C ~ 125°C, 16-WFDFN; Manufacturer: Analog Devices; PartNum: LTC3115EDHD-1#TRPBFCT-ND; Distributor: Digi-Key; PartName: LTC3115EDHD-1#TRPBF
VD1-VD3 = APD240KDTR-G1: Diode Schottky  40V, 2A, 500mV @ 2A, -, SOD-123, -65°C ~ 125°C; Manufacturer: Diodes Incorporated; PartNum: APD240KDTR-G1DICT-ND; Speed: Fast Recovery =< 500ns, > 200mA (Io); Current - Reverse Leakage @ Vr: 500µA @ 40V; Part Number: APD240KDTR-G1; Distributor: Digi-Key; Price: 0.19370; Voltage - DC Reverse (Vr) (Max): 40V; Current - Average Rectified (Io): 2A; Voltage - Forward (Vf) (Max) @ If: 500mV @ 2A; Reverse Recovery Time (trr): -; Operating Temperature: -65°C ~ 125°C; Package / Case: SOD-123
VD4 VD5 = BAT43WS-E3-08: Diode Schottky  30V, 200mA (DC), 450mV @ 15mA, 5ns, SC-76, SOD-323, 125°C (Max); Manufacturer: Vishay Semiconductor Diodes Division; PartNum: BAT43WS-E3-08GICT-ND; Speed: Small Signal =< 200mA (Io), Any Speed; Current - Reverse Leakage @ Vr: 500nA @ 25V; Part Number: BAT43WS-E3-08; Distributor: Digi-Key; Price: 0.37000; Voltage - DC Reverse (Vr) (Max): 30V; Current - Average Rectified (Io): 200mA (DC); Voltage - Forward (Vf) (Max) @ If: 450mV @ 15mA; Reverse Recovery Time (trr): 5ns; Operating Temperature: 125°C (Max); Package / Case: SC-76, SOD-323
X4 = 10132798-022100LF: 20 Position Connector Receptacle, Center Strip Contacts Surface Mount Gold, height 2.7 mm, pitch 0.5 mm; Manufacturer: Amphenol ICC (FCI); PartNum: 609-5029-1-ND; Distributor: Digi-Key; PartName: 10132798-022100LF
Z1 = ABM11-24.000MHZ-D2X-T3: 24 MHz, 10 pF, ±20ppm, 2.00mm x 1.60mm, -40°C ~ 85°C; Manufacturer: Abracon LLC; PartNum: 535-10940-1-ND; Price: 1.36 $; Distributor: Digi-Key; Tolerance: 20 ppm; PartName: ABM11-24.000MHZ-D2X-T3
Z4 = ABS07-32.768KHZ-T: 32.768 kHz, 12.5 pF, 70 kOhm, ±20ppm, 3.2 x 1.5 mm, -40°C ~ 85°C; Manufacturer: Abracon Corporation; PartNum: 535-9542-1-ND; Price: 1.09$; Distributor: Digi-Key; Tolerance: 20 ppm; PartName: ABS07-32.768KHZ-T